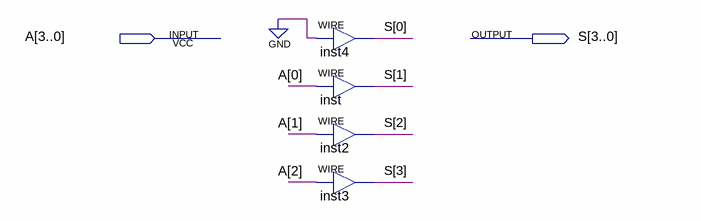
[diagram p0: schematic sheet]
// Quartus schematic double.bdf as structural Verilog: 4 symbols, 2 pins
module double (
  input  [3:0] A,
  output [3:0] S
);

  assign S[0] = 1'b0;  // WIRE inst4
  assign S[1] = A[0];  // WIRE inst
  assign S[2] = A[1];  // WIRE inst2
  assign S[3] = A[2];  // WIRE inst3
endmodule
